# EAGLE schematic ENERGIS_DispBrd_Rack-PDU_1.0.3 (EAGLE 9.2.1)
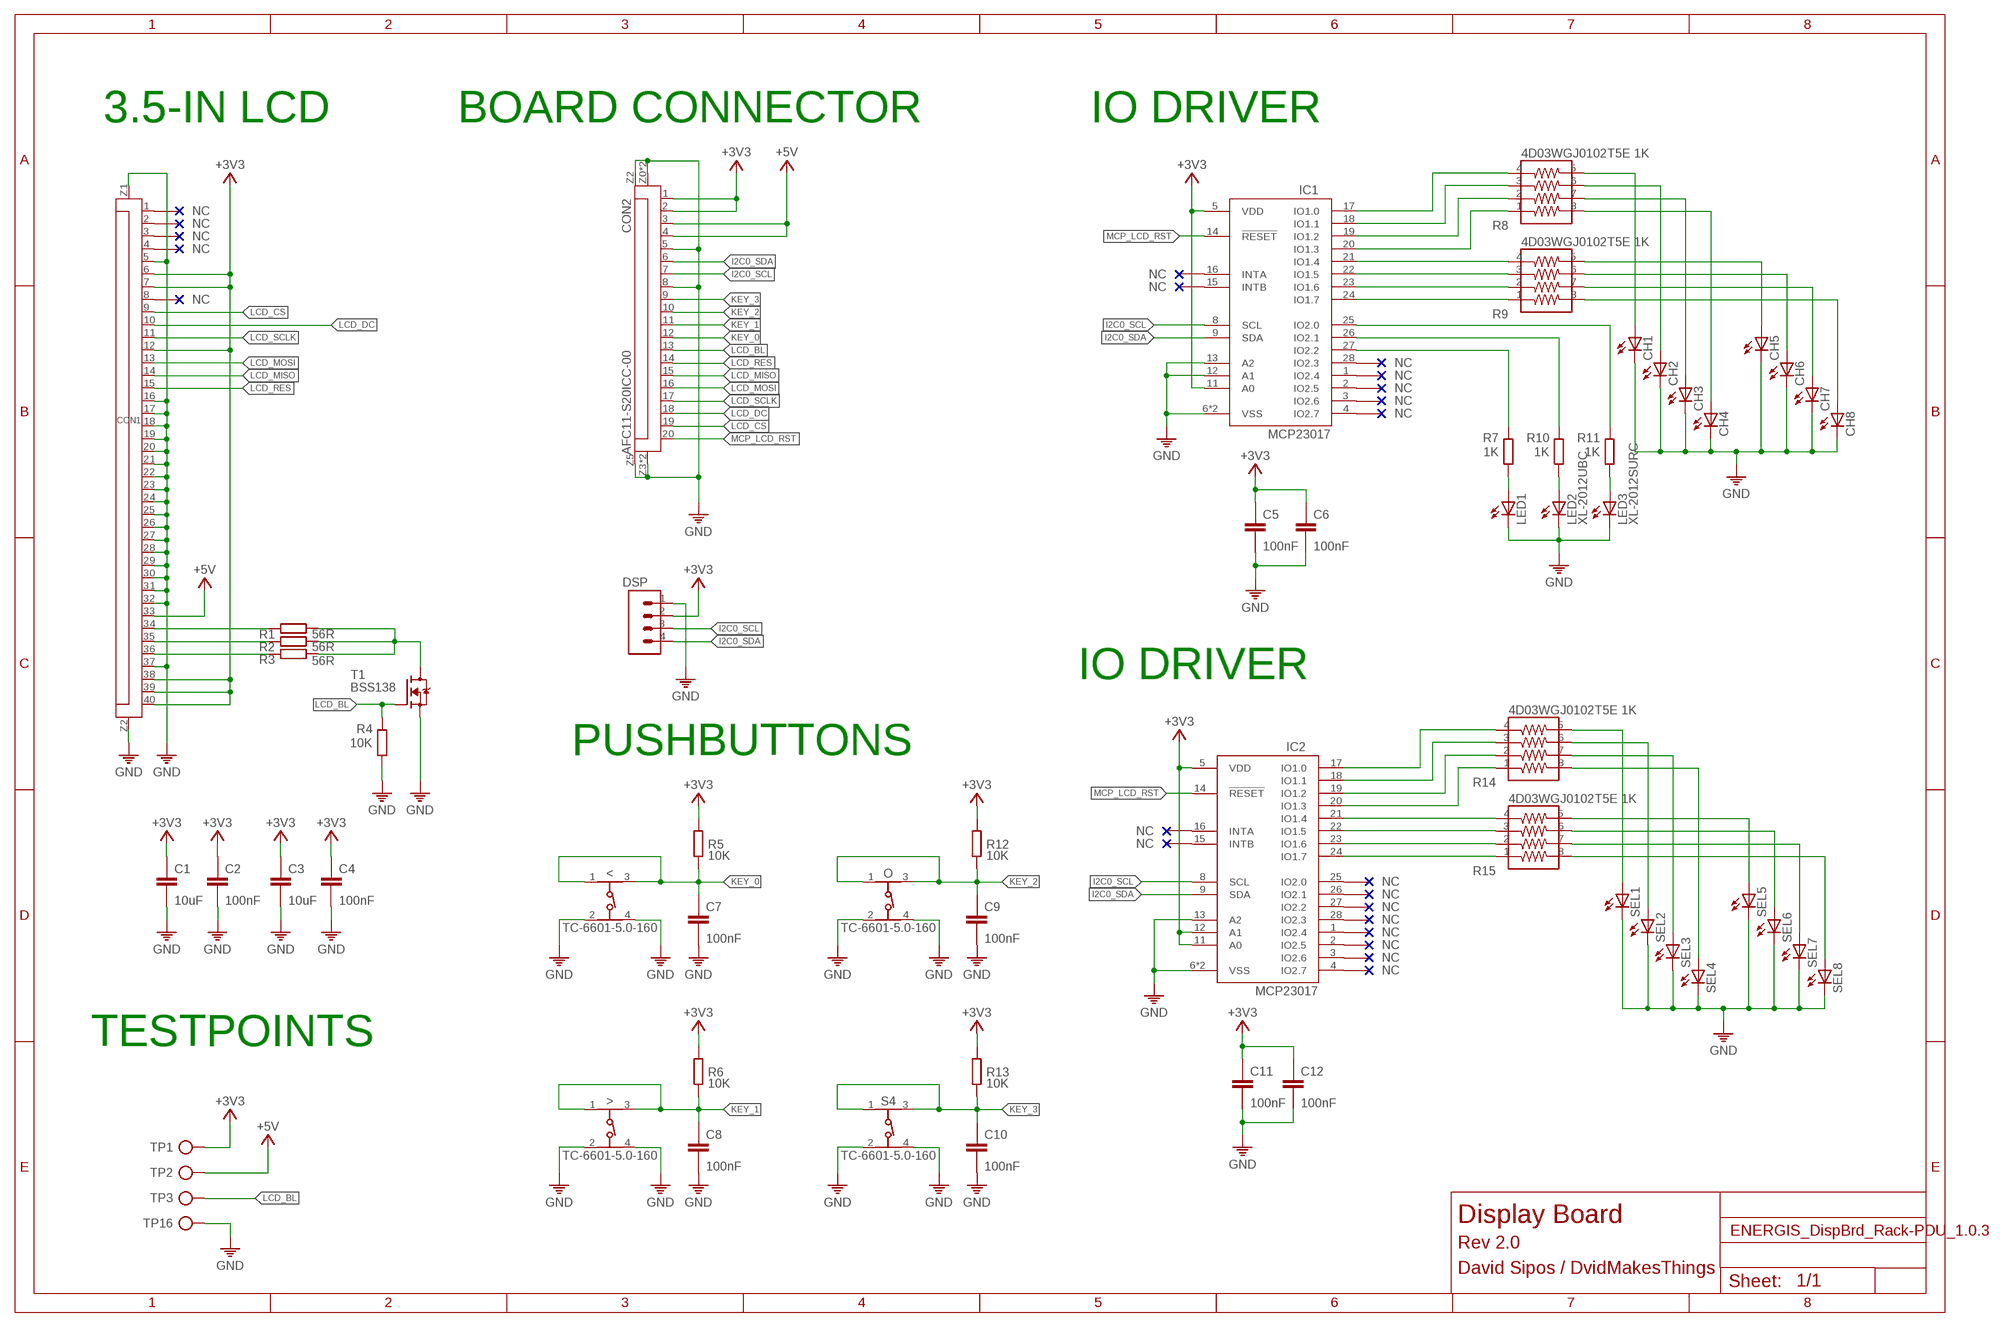
[diagram p0: schematic, sheet 1]

## Parts
<  TC-6601-5.0-160  430182043816  [430182043816]
>  TC-6601-5.0-160  430182043816  [430182043816]
C1  10uF  C-0402  [C0402]
C2  100nF  C-0402  [C0402]
C3  10uF  C-0402  [C0402]
C4  100nF  C-0402  [C0402]
C5  100nF  C-0402  [C0402]
C6  100nF  C-0402  [C0402]
C7  100nF  C-0402  [C0402]
C8  100nF  C-0402  [C0402]
C9  100nF  C-0402  [C0402]
C10  100nF  C-0402  [C0402]
C11  100nF  C-0402  [C0402]
C12  100nF  C-0402  [C0402]
CH1  LEDCHIP-LED0805  [CHIP-LED0805]
CH2  LEDCHIP-LED0805  [CHIP-LED0805]
CH3  LEDCHIP-LED0805  [CHIP-LED0805]
CH4  LEDCHIP-LED0805  [CHIP-LED0805]
CH5  LEDCHIP-LED0805  [CHIP-LED0805]
CH6  LEDCHIP-LED0805  [CHIP-LED0805]
CH7  LEDCHIP-LED0805  [CHIP-LED0805]
CH8  LEDCHIP-LED0805  [CHIP-LED0805]
CON1  FPC40-HD  [FPC40_3.5TFT]
CON2  AFC11-S20ICC-00  [FPC20]
DSP  CON-1X4  [1X4]
IC1  MCP23017-E/ML  [QFN28[6X6]ML]
IC2  MCP23017-E/ML  [QFN28[6X6]ML]
LED1  LED3MM  [LED3MM]
LED2  XL-2012UBC  LED3MM  [LED3MM]
LED3  XL-2012SURC  LED3MM  [LED3MM]
O  TC-6601-5.0-160  430182043816  [430182043816]
R1  56R  R0402  [0402]
R2  56R  R0402  [0402]
R3  56R  R0402  [0402]
R4  10K  R0402  [0402]
R5  10K  R0402  [0402]
R6  10K  R0402  [0402]
R7  1K  R0402  [0402]
R8  4D03WGJ0102T5E 1K  742C083103JP  [742C083103JP]
R9  4D03WGJ0102T5E 1K  742C083103JP  [742C083103JP]
R10  1K  R0402  [0402]
R11  1K  R0402  [0402]
R12  10K  R0402  [0402]
R13  10K  R0402  [0402]
R14  4D03WGJ0102T5E 1K  742C083103JP  [742C083103JP]
R15  4D03WGJ0102T5E 1K  742C083103JP  [742C083103JP]
S4  TC-6601-5.0-160  430182043816  [430182043816]
SEL1  LEDCHIP-LED0805  [CHIP-LED0805]
SEL2  LEDCHIP-LED0805  [CHIP-LED0805]
SEL3  LEDCHIP-LED0805  [CHIP-LED0805]
SEL4  LEDCHIP-LED0805  [CHIP-LED0805]
SEL5  LEDCHIP-LED0805  [CHIP-LED0805]
SEL6  LEDCHIP-LED0805  [CHIP-LED0805]
SEL7  LEDCHIP-LED0805  [CHIP-LED0805]
SEL8  LEDCHIP-LED0805  [CHIP-LED0805]
T1  BSS138  [SOT23]
TP1  TP  [TP]
TP2  TP  [TP]
TP3  TP  [TP]
TP16  TP  [TP]

## Nets
+3V3: C1.1 C2.1 C3.1 C4.1 C5.1 C6.1 C11.1 C12.1 CON1.6 CON1.7 CON1.12 CON1.38 CON1.39 CON1.40 CON2.1 CON2.2 DSP.2 IC1.5(VDD) IC1.11(A0) IC2.5(VDD) IC2.11(A0) IC2.12(A1) R5.1 R6.1 R12.1 R13.1 TP1.TP
+5V: CON1.33 CON2.3 CON2.4 TP2.TP
GND: <.2 <.4 >.2 >.4 C1.2 C2.2 C3.2 C4.2 C5.2 C6.2 C7.2 C8.2 C9.2 C10.2 C11.2 C12.2 CH1.C CH2.C CH3.C CH4.C CH5.C CH6.C CH7.C CH8.C CON1.5 CON1.16 CON1.17 CON1.18 CON1.19 CON1.20 CON1.21 CON1.22 CON1.23 CON1.24 CON1.25 CON1.26 CON1.27 CON1.28 CON1.29 CON1.30 CON1.31 CON1.32 CON1.37 CON1.Z1 CON1.Z2 CON2.5 CON2.8 CON2.Z0(Z1) CON2.Z1 CON2.Z2 CON2.Z3 CON2.Z4(Z3) CON2.Z5(Z4) DSP.1 IC1.6(VSS) IC1.12(A1) IC1.13(A2) IC1.PAD(VSS) IC2.6(VSS) IC2.13(A2) IC2.PAD(VSS) LED1.K(C) LED2.K(C) LED3.K(C) O.2 O.4 R4.2 S4.2 S4.4 SEL1.C SEL2.C SEL3.C SEL4.C SEL5.C SEL6.C SEL7.C SEL8.C T1.2(S) TP16.TP
I2C0_SCL: CON2.7 DSP.3 IC1.8(SCL) IC2.8(SCL)
I2C0_SDA: CON2.6 DSP.4 IC1.9(SDA) IC2.9(SDA)
KEY_0: <.1 <.3 C7.1 CON2.12 R5.2
KEY_1: >.1 >.3 C8.1 CON2.11 R6.2
KEY_2: C9.1 CON2.10 O.1 O.3 R12.2
KEY_3: C10.1 CON2.9 R13.2 S4.1 S4.3
LCD_BL: CON2.13 R4.1 T1.1(G) TP3.TP
LCD_CS: CON1.9 CON2.19
LCD_DC: CON1.10 CON2.18
LCD_MISO: CON1.14 CON2.15
LCD_MOSI: CON1.13 CON2.16
LCD_RES: CON1.15 CON2.14
LCD_SCLK: CON1.11 CON2.17
MCP_LCD_RST: CON2.20 IC1.14(!RESET) IC2.14(!RESET)
N$2: CON1.35 R2.2
N$3: CON1.36 R3.2
N$4: R1.1 R2.1 R3.1 T1.3(D)
N$5: CON1.34 R1.2
N$8: IC2.17(IO1.0) R14.4
N$9: IC2.18(IO1.1) R14.3
N$10: IC2.19(IO1.2) R14.2
N$11: IC2.20(IO1.3) R14.1
N$12: IC2.21(IO1.4) R15.4
N$13: IC2.22(IO1.5) R15.3
N$14: IC2.23(IO1.6) R15.2
N$15: IC2.24(IO1.7) R15.1
N$16: R14.5 SEL1.A
N$17: R14.6 SEL2.A
N$18: R14.7 SEL3.A
N$19: R14.8 SEL4.A
N$20: R15.5 SEL5.A
N$21: R15.6 SEL6.A
N$22: R15.7 SEL7.A
N$23: R15.8 SEL8.A
N$46: IC1.26(IO2.1) R10.1
N$47: IC1.27(IO2.2) R7.1
N$48: IC1.25(IO2.0) R11.1
N$50: IC1.17(IO1.0) R8.4
N$51: IC1.18(IO1.1) R8.3
N$52: IC1.19(IO1.2) R8.2
N$53: IC1.20(IO1.3) R8.1
N$54: IC1.21(IO1.4) R9.4
N$55: IC1.22(IO1.5) R9.3
N$56: IC1.23(IO1.6) R9.2
N$57: IC1.24(IO1.7) R9.1
N$58: CH1.A R8.5
N$59: CH2.A R8.6
N$60: CH3.A R8.7
N$61: CH4.A R8.8
N$62: CH5.A R9.5
N$63: CH6.A R9.6
N$64: CH7.A R9.7
N$65: CH8.A R9.8
N$66: LED3.A R11.2
N$67: LED2.A R10.2
N$68: LED1.A R7.2
Unconnected: CON1.1 CON1.2 CON1.3 CON1.4 CON1.8 IC1.1(IO2.4) IC1.2(IO2.5) IC1.3(IO2.6) IC1.4(IO2.7) IC1.15(INTB) IC1.16(INTA) IC1.28(IO2.3) IC2.1(IO2.4) IC2.2(IO2.5) IC2.3(IO2.6) IC2.4(IO2.7) IC2.15(INTB) IC2.16(INTA) IC2.25(IO2.0) IC2.26(IO2.1) IC2.27(IO2.2) IC2.28(IO2.3)

## Notes on the sheet
- 3.5-IN LCD | BOARD CONNECTOR | IO DRIVER
- IO DRIVER
- PUSHBUTTONS
- TESTPOINTS
- Display Board
- Rev 2.0
- David Sipos / DvidMakesThings

## Library data of the parts
< > O S4 = Wurth_Switch_WS-TASV:430182043816: WS-TASV SMT Tact Switch 6x6 mm Material Properties Cover Material : Stainless Steel Properties Actuator Material:LCP Actuator Flammability :UL94 V-0 Rating Actuator Color:Black; Salmon; White Frame Material:LCP Flammability Rating:UL94 V-0 Frame Color:Black Contact Material:Stainless Steel Contact Plating:Silver Terminal Material:Copper Alloy Terminal Plating:Silver VR:12 V (DC) Contact Resistance Initial:100 mΩ Contact Resistance After Life Test:2Ω RISO:100 MΩ Withstanding Voltage:250 V (AC) Washable:No Qty.:4000;5000 Mechanical Properties Electrical Life:400; 550; 1000 Stroke :0.25 mm General Information Operating Temperature:-40 up to +85 °C Washable:No Packaging Properties Packaging:Tape and Reel <https://www.we-online.com/catalog/media/o37470v209%20Family_WS-TASV_6x6mm_SMD_Tact_Switch_4301820xx8xx.jpg> Details see: https://www.we-online.com/catalog/en/TASV_6X6_SMD/ Updated by yingchun,Shan;2020-02-18 2020(C) Würth Elektronik; DATASHEET-URL: https://www.we-online.com/redexpert/spec/430182043816?ae; HEIGHT: 4.3mm; OPERATION-FORCE: 160g; PART-NUMBER: 430182043816; QTY: 1000; VALUE: 430182043816
C1-C12 = ds_passive:C
CH1-CH8 LED1-LED3 SEL1-SEL8 = led:LED: LED OSRAM: - CHIPLED LG R971, LG N971, LY N971, LG Q971, LY Q971, LO R971, LY R971 LH N974, LH R974 LS Q976, LO Q976, LY Q976 LO Q996 - Hyper CHIPLED LW Q18S LB Q993, LB Q99A, LB R99A - SideLED LS A670, LO A670, LY A670, LG A670, LP A670 LB A673, LV A673, LT A673, LW A673 LH A674 LY A675 LS A676, LA A676, LO A676, LY A676, LW A676 LS A679, LY A679, LG A679 - Hyper Micro SIDELED® LS Y876, LA Y876, LO Y876, LY Y876 LT Y87S - SmartLED LW L88C, LW L88S LB L89C, LB L89S, LG L890 LS L89K, LO L89K, LY L89K LS L896, LA L896, LO L896, LY L896 - TOPLED LS T670, LO T670, LY T670, LG T670, LP T670 LSG T670, LSP T670, LSY T670, LOP T670, LYG T670 LG T671, LOG T671, LSG T671 LB T673, LV T673, LT T673, LW T673 LH T674 LS T676, LA T676, LO T676, LY T676, LB T676, LH T676, LSB T676, LW T676 LB T67C, LV T67C, LT T67C, LS T67K, LO T67K, LY T67K, LW E67C LS E67B, LA E67B, LO E67B, LY E67B, LB E67C, LV E67C, LT E67C LW T67C LS T679, LY T679, LG T679 LS T770, LO T770, LY T770, LG T770, LP T770 LB T773, LV T773, LT T773, LW T773 LH T774 LS E675, LA E675, LY E675, LS T675 LS T776, LA T776, LO T776, LY T776, LB T776 LHGB T686 LT T68C, LB T68C - Hyper Mini TOPLED® LB M676 - Mini TOPLED Santana® LG M470 LS M47K, LO M47K, LY M47K Source: http://www.osram.convergy.de LUXEON: - LUMILED® LXK2-PW12-R00, LXK2-PW12-S00, LXK2-PW14-U00, LXK2-PW14-V00 LXK2-PM12-R00, LXK2-PM12-S00, LXK2-PM14-U00 LXK2-PE12-Q00, LXK2-PE12-R00, LXK2-PE12-S00, LXK2-PE14-T00, LXK2-PE14-U00 LXK2-PB12-K00, LXK2-PB12-L00, LXK2-PB12-M00, LXK2-PB14-N00, LXK2-PB14-P00, LXK2-PB14-Q00 LXK2-PR12-L00, LXK2-PR12-M00, LXK2-PR14-Q00, LXK2-PR14-R00 LXK2-PD12-Q00, LXK2-PD12-R00, LXK2-PD12-S00 LXK2-PH12-R00, LXK2-PH12-S00 LXK2-PL12-P00, LXK2-PL12-Q00, LXK2-PL12-R00 Source: www.luxeon.com KINGBRIGHT: KA-3528ASYC Source: www.kingbright.com
CON1 = ds_con:FPC40-H
CON2 = ds_con:AFC11-S20ICC-00
DSP = ds_con:CON-1X4
IC1 IC2 = ds_ic_peripherals:MCP23017: 16-Bit I2C I/O Expander with Serial Interface
R1-R7 R10-R13 = ds_passive:R
R8 R9 R14 R15 = Resistor Array:742C083103JP: RES ARRAY 4 RES 10K OHM 1206 Manufacturer's datasheet <https://www.ctscorp.com/wp-content/uploads/74x.pdf>; CREATED_BY: PCBLayout.com; DIGIKEY_PN: 742C083103JPTR-ND; MANUFACTURER: CTS Resistor Products; MPN: 742C083103JP; PACKAGE: 1206
T1 = transistor-fet:BSS138: N-Channel Logic Level Enhancement Mode Field Effect Transistor
TP1-TP3 TP16 = ds_passive:TP

## Net classes
0 default: width 0.2 mm, drill 0.35 mm, clearance 0.191 mm